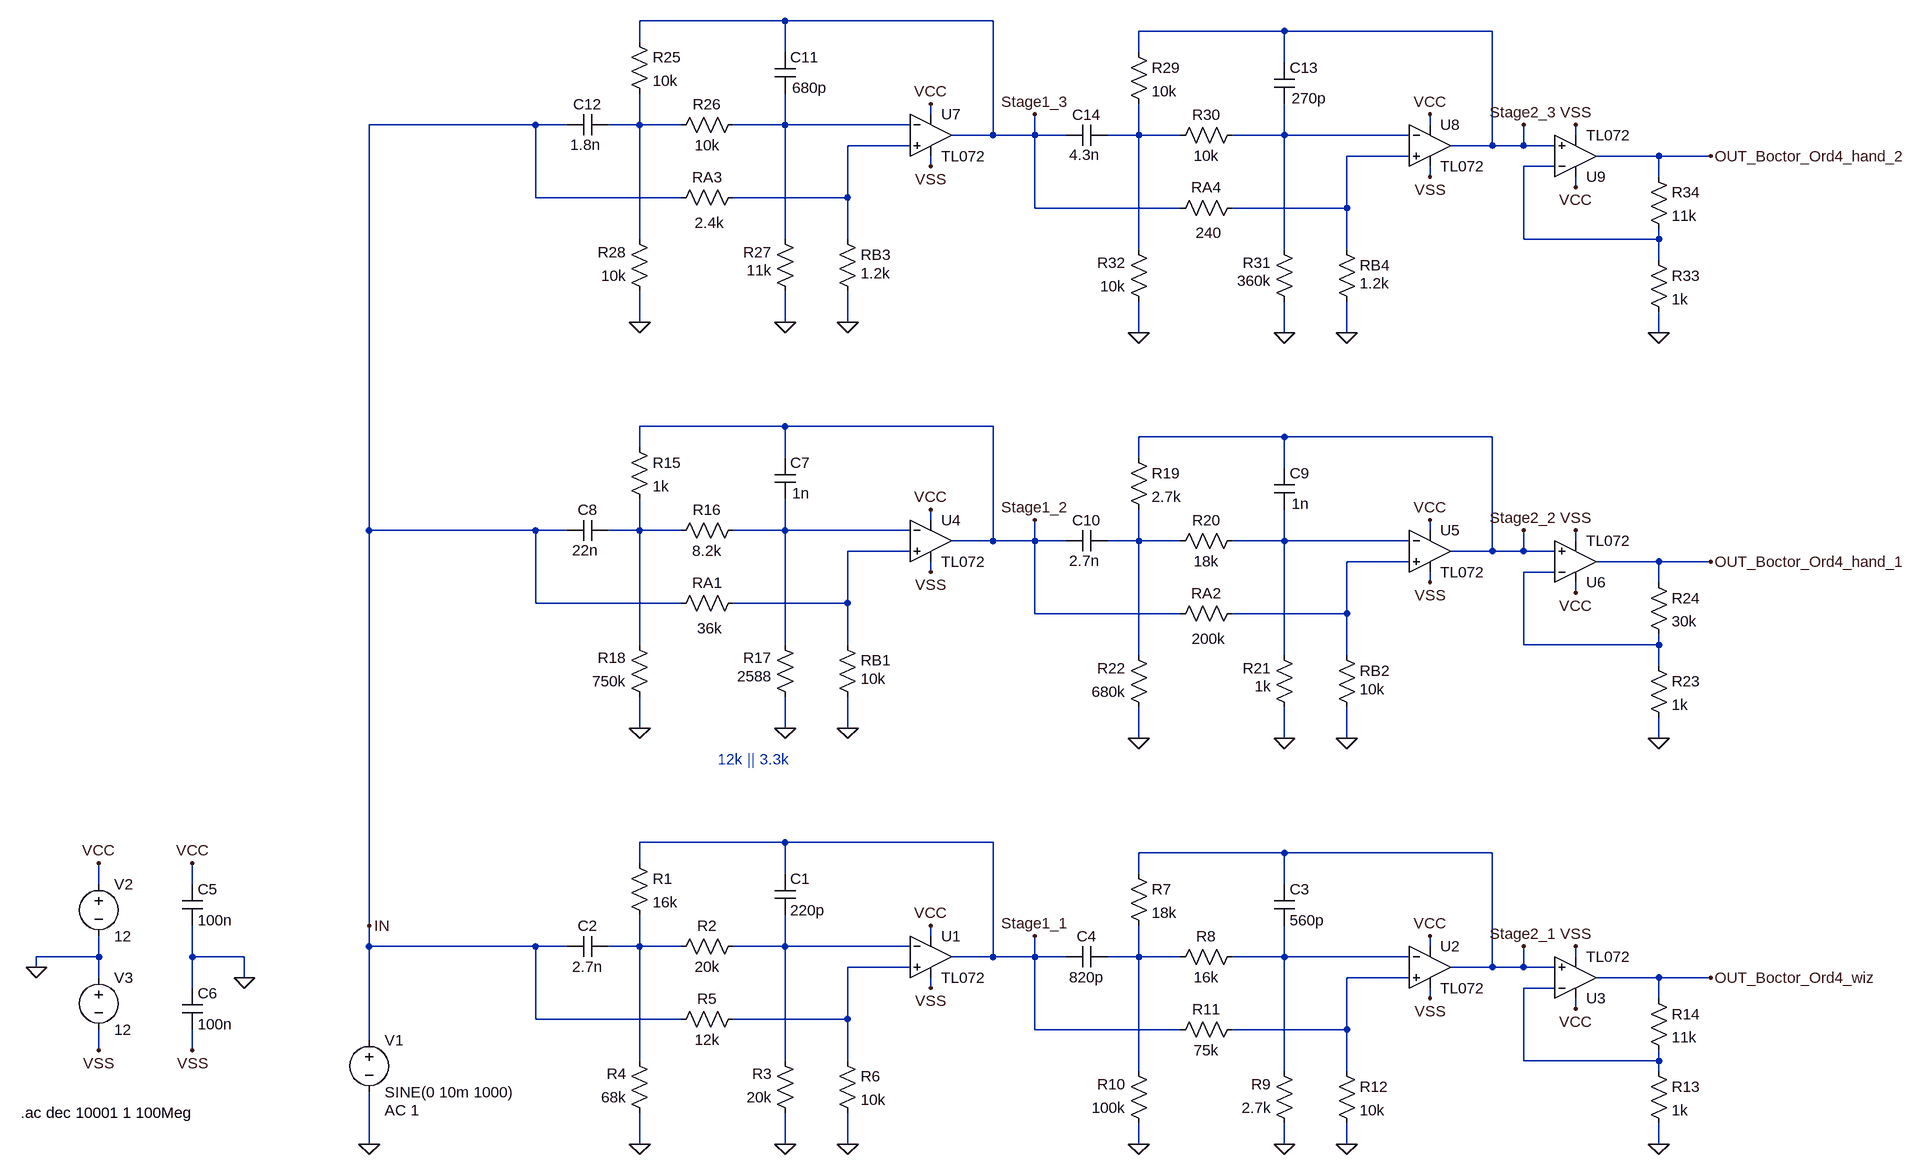
[diagram p0: schematic Boctor_ordnung4_10kHz_1dB_30dB_inv_cheby.asc]
Boctor_ordnung4_10kHz_1dB_30dB_inv_cheby.asc, the LTspice schematic file:
Version 4
SHEET 1 2660 736
WIRE 448 -1136 224 -1136
WIRE 768 -1136 448 -1136
WIRE 1216 -1120 992 -1120
WIRE 1536 -1120 1216 -1120
WIRE 224 -1104 224 -1136
WIRE 448 -1088 448 -1136
WIRE 992 -1088 992 -1120
WIRE 1216 -1072 1216 -1120
WIRE 672 -992 672 -1008
WIRE 64 -976 -192 -976
WIRE 112 -976 64 -976
WIRE 224 -976 224 -1024
WIRE 224 -976 176 -976
WIRE 288 -976 224 -976
WIRE 448 -976 448 -1024
WIRE 448 -976 368 -976
WIRE 640 -976 448 -976
WIRE 1440 -976 1440 -992
WIRE 768 -960 768 -1136
WIRE 768 -960 704 -960
WIRE 832 -960 832 -992
WIRE 832 -960 768 -960
WIRE 880 -960 832 -960
WIRE 992 -960 992 -1008
WIRE 992 -960 944 -960
WIRE 1056 -960 992 -960
WIRE 1216 -960 1216 -1008
WIRE 1216 -960 1136 -960
WIRE 1408 -960 1216 -960
WIRE 1664 -960 1664 -976
WIRE 640 -944 544 -944
WIRE 1536 -944 1536 -1120
WIRE 1536 -944 1472 -944
WIRE 1584 -944 1584 -976
WIRE 1584 -944 1536 -944
WIRE 1632 -944 1584 -944
WIRE 1408 -928 1312 -928
WIRE 1792 -928 1696 -928
WIRE 1872 -928 1792 -928
WIRE 672 -912 672 -928
WIRE 1632 -912 1584 -912
WIRE 1440 -896 1440 -912
WIRE 1792 -896 1792 -928
WIRE 1664 -880 1664 -896
WIRE 64 -864 64 -976
WIRE 288 -864 64 -864
WIRE 544 -864 544 -944
WIRE 544 -864 368 -864
WIRE 832 -848 832 -960
WIRE 1056 -848 832 -848
WIRE 1312 -848 1312 -928
WIRE 1312 -848 1136 -848
WIRE 224 -800 224 -976
WIRE 448 -800 448 -976
WIRE 544 -800 544 -864
WIRE 1584 -800 1584 -912
WIRE 1792 -800 1792 -816
WIRE 1792 -800 1584 -800
WIRE 992 -784 992 -960
WIRE 1216 -784 1216 -960
WIRE 1312 -784 1312 -848
WIRE 1792 -768 1792 -800
WIRE 224 -672 224 -720
WIRE 448 -672 448 -720
WIRE 544 -672 544 -720
WIRE 992 -656 992 -704
WIRE 1216 -656 1216 -704
WIRE 1312 -656 1312 -704
WIRE 1792 -656 1792 -688
WIRE 448 -512 224 -512
WIRE 768 -512 448 -512
WIRE 1216 -496 992 -496
WIRE 1536 -496 1216 -496
WIRE 224 -480 224 -512
WIRE 448 -464 448 -512
WIRE 992 -464 992 -496
WIRE 1216 -448 1216 -496
WIRE 672 -368 672 -384
WIRE -192 -352 -192 -976
WIRE 64 -352 -192 -352
WIRE 112 -352 64 -352
WIRE 224 -352 224 -400
WIRE 224 -352 176 -352
WIRE 288 -352 224 -352
WIRE 448 -352 448 -400
WIRE 448 -352 368 -352
WIRE 640 -352 448 -352
WIRE 1440 -352 1440 -368
WIRE 768 -336 768 -512
WIRE 768 -336 704 -336
WIRE 832 -336 832 -368
WIRE 832 -336 768 -336
WIRE 880 -336 832 -336
WIRE 992 -336 992 -384
WIRE 992 -336 944 -336
WIRE 1056 -336 992 -336
WIRE 1216 -336 1216 -384
WIRE 1216 -336 1136 -336
WIRE 1408 -336 1216 -336
WIRE 1664 -336 1664 -352
WIRE 640 -320 544 -320
WIRE 1536 -320 1536 -496
WIRE 1536 -320 1472 -320
WIRE 1584 -320 1584 -352
WIRE 1584 -320 1536 -320
WIRE 1632 -320 1584 -320
WIRE 1408 -304 1312 -304
WIRE 1792 -304 1696 -304
WIRE 1872 -304 1792 -304
WIRE 672 -288 672 -304
WIRE 1632 -288 1584 -288
WIRE 1440 -272 1440 -288
WIRE 1792 -272 1792 -304
WIRE 1664 -256 1664 -272
WIRE 64 -240 64 -352
WIRE 288 -240 64 -240
WIRE 544 -240 544 -320
WIRE 544 -240 368 -240
WIRE 832 -224 832 -336
WIRE 1056 -224 832 -224
WIRE 1312 -224 1312 -304
WIRE 1312 -224 1136 -224
WIRE 224 -176 224 -352
WIRE 448 -176 448 -352
WIRE 544 -176 544 -240
WIRE 1584 -176 1584 -288
WIRE 1792 -176 1792 -192
WIRE 1792 -176 1584 -176
WIRE 992 -160 992 -336
WIRE 1216 -160 1216 -336
WIRE 1312 -160 1312 -224
WIRE 1792 -144 1792 -176
WIRE 224 -48 224 -96
WIRE 448 -48 448 -96
WIRE 544 -48 544 -96
WIRE 992 -32 992 -80
WIRE 1216 -32 1216 -80
WIRE 1312 -32 1312 -80
WIRE 1792 -32 1792 -64
WIRE 448 128 224 128
WIRE 768 128 448 128
WIRE 1216 144 992 144
WIRE 1536 144 1216 144
WIRE 224 160 224 128
WIRE 448 176 448 128
WIRE 992 176 992 144
WIRE -608 192 -608 160
WIRE -464 192 -464 160
WIRE 1216 192 1216 144
WIRE -192 256 -192 -352
WIRE 672 272 672 256
WIRE -192 288 -192 256
WIRE 64 288 -192 288
WIRE 112 288 64 288
WIRE 224 288 224 240
WIRE 224 288 176 288
WIRE 288 288 224 288
WIRE 448 288 448 240
WIRE 448 288 368 288
WIRE 640 288 448 288
WIRE 1440 288 1440 272
WIRE -608 304 -608 272
WIRE -608 304 -704 304
WIRE -464 304 -464 256
WIRE -384 304 -464 304
WIRE 768 304 768 128
WIRE 768 304 704 304
WIRE 832 304 832 272
WIRE 832 304 768 304
WIRE 880 304 832 304
WIRE 992 304 992 256
WIRE 992 304 944 304
WIRE 1056 304 992 304
WIRE 1216 304 1216 256
WIRE 1216 304 1136 304
WIRE 1408 304 1216 304
WIRE 1664 304 1664 288
WIRE -704 320 -704 304
WIRE 640 320 544 320
WIRE 1536 320 1536 144
WIRE 1536 320 1472 320
WIRE 1584 320 1584 288
WIRE 1584 320 1536 320
WIRE 1632 320 1584 320
WIRE -608 336 -608 304
WIRE -384 336 -384 304
WIRE 1408 336 1312 336
WIRE 1792 336 1696 336
WIRE 1872 336 1792 336
WIRE -464 352 -464 304
WIRE 672 352 672 336
WIRE 1632 352 1584 352
WIRE 1440 368 1440 352
WIRE 1792 368 1792 336
WIRE 1664 384 1664 368
WIRE 64 400 64 288
WIRE 288 400 64 400
WIRE 544 400 544 320
WIRE 544 400 368 400
WIRE 832 416 832 304
WIRE 1056 416 832 416
WIRE 1312 416 1312 336
WIRE 1312 416 1136 416
WIRE -192 432 -192 288
WIRE -608 448 -608 416
WIRE -464 448 -464 416
WIRE 224 464 224 288
WIRE 448 464 448 288
WIRE 544 464 544 400
WIRE 1584 464 1584 352
WIRE 1792 464 1792 448
WIRE 1792 464 1584 464
WIRE 992 480 992 304
WIRE 1216 480 1216 304
WIRE 1312 480 1312 416
WIRE 1792 480 1792 464
WIRE -192 592 -192 512
WIRE 224 592 224 544
WIRE 448 592 448 544
WIRE 544 592 544 544
WIRE 992 592 992 560
WIRE 1216 592 1216 560
WIRE 1312 592 1312 560
WIRE 1792 592 1792 560
FLAG -608 160 VCC
FLAG -608 448 VSS
FLAG -704 320 0
FLAG -464 160 VCC
FLAG -464 448 VSS
FLAG -384 336 0
FLAG -192 592 0
FLAG 672 256 VCC
FLAG 672 352 VSS
FLAG 224 592 0
FLAG 448 592 0
FLAG 544 592 0
FLAG -192 256 IN
FLAG 1440 272 VCC
FLAG 1440 368 VSS
FLAG 992 592 0
FLAG 1216 592 0
FLAG 1312 592 0
FLAG 832 272 Stage1_1
FLAG 1792 592 0
FLAG 1664 288 VSS
FLAG 1664 384 VCC
FLAG 1872 336 OUT_Boctor_Ord4_wiz
FLAG 1584 288 Stage2_1
FLAG 672 -384 VCC
FLAG 672 -288 VSS
FLAG 224 -48 0
FLAG 448 -48 0
FLAG 544 -48 0
FLAG 832 -368 Stage1_2
FLAG 1440 -368 VCC
FLAG 1440 -272 VSS
FLAG 992 -32 0
FLAG 1216 -32 0
FLAG 1312 -32 0
FLAG 1792 -32 0
FLAG 1664 -352 VSS
FLAG 1664 -256 VCC
FLAG 1872 -304 OUT_Boctor_Ord4_hand_1
FLAG 1584 -352 Stage2_2
FLAG 672 -1008 VCC
FLAG 672 -912 VSS
FLAG 224 -672 0
FLAG 448 -672 0
FLAG 544 -672 0
FLAG 832 -992 Stage1_3
FLAG 1440 -992 VCC
FLAG 1440 -896 VSS
FLAG 992 -656 0
FLAG 1216 -656 0
FLAG 1312 -656 0
FLAG 1792 -656 0
FLAG 1664 -976 VSS
FLAG 1664 -880 VCC
FLAG 1872 -928 OUT_Boctor_Ord4_hand_2
FLAG 1584 -976 Stage2_3
SYMBOL voltage -192 416 R0
WINDOW 123 24 124 Left 2
WINDOW 39 0 0 Left 0
SYMATTR Value2 AC 1
SYMATTR InstName V1
SYMATTR Value SINE(0 10m 1000)
SYMBOL voltage -608 176 R0
WINDOW 123 0 0 Left 0
WINDOW 39 0 0 Left 0
SYMATTR InstName V2
SYMATTR Value 12
SYMBOL voltage -608 320 R0
WINDOW 123 0 0 Left 0
WINDOW 39 0 0 Left 0
SYMATTR InstName V3
SYMATTR Value 12
SYMBOL cap -480 192 R0
SYMATTR InstName C5
SYMATTR Value 100n
SYMBOL cap -480 352 R0
SYMATTR InstName C6
SYMATTR Value 100n
SYMBOL res 208 144 R0
SYMATTR InstName R1
SYMATTR Value 16k
SYMBOL res 384 272 R90
WINDOW 0 0 56 VBottom 2
WINDOW 3 32 56 VTop 2
SYMATTR InstName R2
SYMATTR Value 20k
SYMBOL res 464 560 R180
WINDOW 0 36 76 Left 2
WINDOW 3 36 40 Left 2
SYMATTR InstName R3
SYMATTR Value 20k
SYMBOL res 240 560 R180
WINDOW 0 36 76 Left 2
WINDOW 3 36 40 Left 2
SYMATTR InstName R4
SYMATTR Value 68k
SYMBOL res 272 416 R270
WINDOW 0 32 56 VTop 2
WINDOW 3 0 56 VBottom 2
SYMATTR InstName R5
SYMATTR Value 12k
SYMBOL res 528 448 R0
SYMATTR InstName R6
SYMATTR Value 10k
SYMBOL cap 432 176 R0
SYMATTR InstName C1
SYMATTR Value 220p
SYMBOL cap 176 272 R90
WINDOW 0 0 32 VBottom 2
WINDOW 3 32 32 VTop 2
SYMATTR InstName C2
SYMATTR Value 2.7n
SYMBOL TL072 672 240 R0
SYMATTR InstName U1
SYMBOL res 976 160 R0
SYMATTR InstName R7
SYMATTR Value 18k
SYMBOL res 1152 288 R90
WINDOW 0 0 56 VBottom 2
WINDOW 3 32 56 VTop 2
SYMATTR InstName R8
SYMATTR Value 16k
SYMBOL res 1232 576 R180
WINDOW 0 36 76 Left 2
WINDOW 3 36 40 Left 2
SYMATTR InstName R9
SYMATTR Value 2.7k
SYMBOL res 1008 576 R180
WINDOW 0 36 76 Left 2
WINDOW 3 36 40 Left 2
SYMATTR InstName R10
SYMATTR Value 100k
SYMBOL res 1040 432 R270
WINDOW 0 32 56 VTop 2
WINDOW 3 0 56 VBottom 2
SYMATTR InstName R11
SYMATTR Value 75k
SYMBOL res 1296 464 R0
SYMATTR InstName R12
SYMATTR Value 10k
SYMBOL cap 1200 192 R0
SYMATTR InstName C3
SYMATTR Value 560p
SYMBOL cap 944 288 R90
WINDOW 0 0 32 VBottom 2
WINDOW 3 32 32 VTop 2
SYMATTR InstName C4
SYMATTR Value 820p
SYMBOL TL072 1440 256 R0
SYMATTR InstName U2
SYMBOL res 1776 464 R0
SYMATTR InstName R13
SYMATTR Value 1k
SYMBOL res 1776 352 R0
SYMATTR InstName R14
SYMATTR Value 11k
SYMBOL TL072 1664 400 M180
SYMATTR InstName U3
SYMBOL res 208 -496 R0
SYMATTR InstName R15
SYMATTR Value 1k
SYMBOL res 384 -368 R90
WINDOW 0 0 56 VBottom 2
WINDOW 3 32 56 VTop 2
SYMATTR InstName R16
SYMATTR Value 8.2k
SYMBOL res 464 -80 R180
WINDOW 0 36 76 Left 2
WINDOW 3 36 48 Left 2
SYMATTR InstName R17
SYMATTR Value 2588
SYMBOL res 240 -80 R180
WINDOW 0 36 76 Left 2
WINDOW 3 36 40 Left 2
SYMATTR InstName R18
SYMATTR Value 750k
SYMBOL res 272 -224 R270
WINDOW 0 32 56 VTop 2
WINDOW 3 -38 60 VTop 2
SYMATTR InstName RA1
SYMATTR Value 36k
SYMBOL res 528 -192 R0
WINDOW 3 36 68 Left 2
SYMATTR Value 10k
SYMATTR InstName RB1
SYMBOL cap 432 -464 R0
WINDOW 3 27 55 Left 2
SYMATTR Value 1n
SYMATTR InstName C7
SYMBOL cap 176 -368 R90
WINDOW 0 0 32 VBottom 2
WINDOW 3 62 35 VBottom 2
SYMATTR InstName C8
SYMATTR Value 22n
SYMBOL TL072 672 -400 R0
SYMATTR InstName U4
SYMBOL res 976 -480 R0
SYMATTR InstName R19
SYMATTR Value 2.7k
SYMBOL res 1152 -352 R90
WINDOW 0 0 56 VBottom 2
WINDOW 3 32 56 VTop 2
SYMATTR InstName R20
SYMATTR Value 18k
SYMBOL res 1232 -64 R180
WINDOW 0 36 76 Left 2
WINDOW 3 36 48 Left 2
SYMATTR InstName R21
SYMATTR Value 1k
SYMBOL res 1008 -64 R180
WINDOW 0 36 76 Left 2
WINDOW 3 36 40 Left 2
SYMATTR InstName R22
SYMATTR Value 680k
SYMBOL res 1040 -208 R270
WINDOW 0 32 56 VTop 2
WINDOW 3 -38 60 VTop 2
SYMATTR InstName RA2
SYMATTR Value 200k
SYMBOL res 1296 -176 R0
WINDOW 3 36 68 Left 2
SYMATTR Value 10k
SYMATTR InstName RB2
SYMBOL cap 1200 -448 R0
WINDOW 3 27 55 Left 2
SYMATTR Value 1n
SYMATTR InstName C9
SYMBOL cap 944 -352 R90
WINDOW 0 0 32 VBottom 2
WINDOW 3 62 35 VBottom 2
SYMATTR InstName C10
SYMATTR Value 2.7n
SYMBOL TL072 1440 -384 R0
SYMATTR InstName U5
SYMBOL res 1776 -160 R0
SYMATTR InstName R23
SYMATTR Value 1k
SYMBOL res 1776 -288 R0
SYMATTR InstName R24
SYMATTR Value 30k
SYMBOL TL072 1664 -240 M180
SYMATTR InstName U6
SYMBOL res 208 -1120 R0
SYMATTR InstName R25
SYMATTR Value 10k
SYMBOL res 384 -992 R90
WINDOW 0 0 56 VBottom 2
WINDOW 3 32 56 VTop 2
SYMATTR InstName R26
SYMATTR Value 10k
SYMBOL res 464 -704 R180
WINDOW 0 36 76 Left 2
WINDOW 3 36 48 Left 2
SYMATTR InstName R27
SYMATTR Value 11k
SYMBOL res 240 -704 R180
WINDOW 0 36 76 Left 2
WINDOW 3 36 40 Left 2
SYMATTR InstName R28
SYMATTR Value 10k
SYMBOL res 272 -848 R270
WINDOW 0 32 56 VTop 2
WINDOW 3 -38 60 VTop 2
SYMATTR InstName RA3
SYMATTR Value 2.4k
SYMBOL res 528 -816 R0
WINDOW 3 36 68 Left 2
SYMATTR Value 1.2k
SYMATTR InstName RB3
SYMBOL cap 432 -1088 R0
WINDOW 3 27 55 Left 2
SYMATTR Value 680p
SYMATTR InstName C11
SYMBOL cap 176 -992 R90
WINDOW 0 0 32 VBottom 2
WINDOW 3 62 35 VBottom 2
SYMATTR InstName C12
SYMATTR Value 1.8n
SYMBOL TL072 672 -1024 R0
SYMATTR InstName U7
SYMBOL res 976 -1104 R0
SYMATTR InstName R29
SYMATTR Value 10k
SYMBOL res 1152 -976 R90
WINDOW 0 0 56 VBottom 2
WINDOW 3 32 56 VTop 2
SYMATTR InstName R30
SYMATTR Value 10k
SYMBOL res 1232 -688 R180
WINDOW 0 36 76 Left 2
WINDOW 3 36 48 Left 2
SYMATTR InstName R31
SYMATTR Value 360k
SYMBOL res 1008 -688 R180
WINDOW 0 36 76 Left 2
WINDOW 3 36 40 Left 2
SYMATTR InstName R32
SYMATTR Value 10k
SYMBOL res 1040 -832 R270
WINDOW 0 32 56 VTop 2
WINDOW 3 -38 60 VTop 2
SYMATTR InstName RA4
SYMATTR Value 240
SYMBOL res 1296 -800 R0
WINDOW 3 36 68 Left 2
SYMATTR Value 1.2k
SYMATTR InstName RB4
SYMBOL cap 1200 -1072 R0
WINDOW 3 27 55 Left 2
SYMATTR Value 270p
SYMATTR InstName C13
SYMBOL cap 944 -976 R90
WINDOW 0 0 32 VBottom 2
WINDOW 3 62 35 VBottom 2
SYMATTR InstName C14
SYMATTR Value 4.3n
SYMBOL TL072 1440 -1008 R0
SYMATTR InstName U8
SYMBOL res 1776 -784 R0
SYMATTR InstName R33
SYMATTR Value 1k
SYMBOL res 1776 -912 R0
SYMATTR InstName R34
SYMATTR Value 11k
SYMBOL TL072 1664 -864 M180
SYMATTR InstName U9
TEXT -728 544 Left 2 !.ac dec 10001 1 100Meg
TEXT 344 0 Left 2 ;12k || 3.3k

The netlist it stands for:
* Boctor_ordnung4_10kHz_1dB_30dB_inv_cheby.asc
V1 IN 0 SINE(0 10m 1000) AC 1
V2 VCC 0 12
V3 0 VSS 12
C5 VCC 0 100n
C6 0 VSS 100n
R1 Stage1_1 N015 16k
R2 N016 N015 20k
R3 0 N016 20k
R4 0 N015 68k
R5 IN N019 12k
R6 N019 0 10k
C1 Stage1_1 N016 220p
C2 N015 IN 2.7n
* U1: TL072 (symbol TL072 not available, pins judged from their places): In+=N019 In-=N016 V+=VCC V-=VSS OUT=Stage1_1
R7 Stage2_1 N017 18k
R8 N018 N017 16k
R9 0 N018 2.7k
R10 0 N017 100k
R11 Stage1_1 N020 75k
R12 N020 0 10k
C3 Stage2_1 N018 560p
C4 N017 Stage1_1 820p
* U2: TL072 (symbol TL072 not available, pins judged from their places): In+=N020 In-=N018 V+=VCC V-=VSS OUT=Stage2_1
R13 N021 0 1k
R14 OUT_Boctor_Ord4_wiz N021 11k
* U3: TL072 (symbol TL072 not available, pins judged from their places): In+=Stage2_1 In-=N021 V+=VCC V-=VSS OUT=OUT_Boctor_Ord4_wiz
R15 Stage1_2 N008 1k
R16 N009 N008 8.2k
R17 0 N009 2588
R18 0 N008 750k
RA1 IN N012 36k
RB1 N012 0 10k
C7 Stage1_2 N009 1n
C8 N008 IN 22n
* U4: TL072 (symbol TL072 not available, pins judged from their places): In+=N012 In-=N009 V+=VCC V-=VSS OUT=Stage1_2
R19 Stage2_2 N010 2.7k
R20 N011 N010 18k
R21 0 N011 1k
R22 0 N010 680k
RA2 Stage1_2 N013 200k
RB2 N013 0 10k
C9 Stage2_2 N011 1n
C10 N010 Stage1_2 2.7n
* U5: TL072 (symbol TL072 not available, pins judged from their places): In+=N013 In-=N011 V+=VCC V-=VSS OUT=Stage2_2
R23 N014 0 1k
R24 OUT_Boctor_Ord4_hand_1 N014 30k
* U6: TL072 (symbol TL072 not available, pins judged from their places): In+=Stage2_2 In-=N014 V+=VCC V-=VSS OUT=OUT_Boctor_Ord4_hand_1
R25 Stage1_3 N001 10k
R26 N002 N001 10k
R27 0 N002 11k
R28 0 N001 10k
RA3 IN N005 2.4k
RB3 N005 0 1.2k
C11 Stage1_3 N002 680p
C12 N001 IN 1.8n
* U7: TL072 (symbol TL072 not available, pins judged from their places): In+=N005 In-=N002 V+=VCC V-=VSS OUT=Stage1_3
R29 Stage2_3 N003 10k
R30 N004 N003 10k
R31 0 N004 360k
R32 0 N003 10k
RA4 Stage1_3 N006 240
RB4 N006 0 1.2k
C13 Stage2_3 N004 270p
C14 N003 Stage1_3 4.3n
* U8: TL072 (symbol TL072 not available, pins judged from their places): In+=N006 In-=N004 V+=VCC V-=VSS OUT=Stage2_3
R33 N007 0 1k
R34 OUT_Boctor_Ord4_hand_2 N007 11k
* U9: TL072 (symbol TL072 not available, pins judged from their places): In+=Stage2_3 In-=N007 V+=VCC V-=VSS OUT=OUT_Boctor_Ord4_hand_2
.ac dec 10001 1 100Meg
* 12k || 3.3k
.backanno
.end